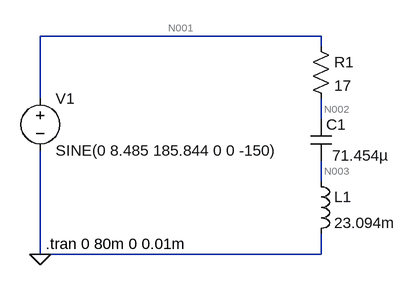
[diagram p0: schematic Lab3_2_6_14.asc]
Lab3_2_6_14.asc, the LTspice schematic file:
Version 4
SHEET 1 880 680
WIRE 512 16 80 16
WIRE 512 32 512 16
WIRE 80 112 80 16
WIRE 512 144 512 112
WIRE 512 240 512 208
WIRE 80 352 80 192
WIRE 512 352 512 320
WIRE 512 352 80 352
FLAG 80 352 0
SYMBOL voltage 80 96 R0
WINDOW 123 0 0 Left 0
WINDOW 39 0 0 Left 0
SYMATTR InstName V1
SYMATTR Value SINE(0 8.485 185.844 0 0 -150)
SYMBOL res 496 16 R0
SYMATTR InstName R1
SYMATTR Value 17
SYMBOL cap 496 144 R0
WINDOW 3 33 56 Left 2
SYMATTR Value 71.454µ
SYMATTR InstName C1
SYMBOL ind 496 224 R0
SYMATTR InstName L1
SYMATTR Value 23.094m
SYMATTR SpiceLine Rser=5
TEXT 88 336 Left 2 !.tran 0 80m 0 0.01m

The netlist it stands for:
* Lab3_2_6_14.asc
V1 N001 0 SINE(0 8.485 185.844 0 0 -150)
R1 N001 N002 17
C1 N002 N003 71.454µ
L1 N003 0 23.094m Rser=5
.tran 0 80m 0 0.01m
.backanno
.end

* Results of the author's LTspice run, read from the files saved beside the schematic
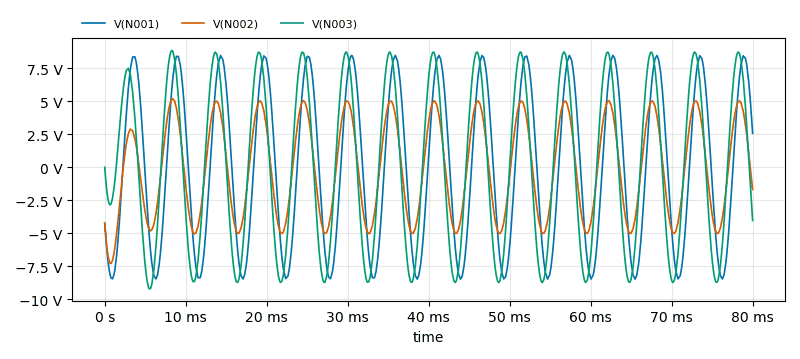
[diagram p1: Transient Analysis of Lab3_2_6_14.asc, plotted from the saved traces]
* Transient Analysis, 1 run:
*   V(N001): min -8.484 V, max 8.484 V, average 7.527 mV, rms 6.007 V, last 2.579 V
*   V(N002): min -7.307 V, max 5.199 V, average -92.51 mV, rms 3.588 V, last -1.689 V
*   V(N003): min -9.217 V, max 8.862 V, average 101.6 mV, rms 6.101 V, last -4.044 V